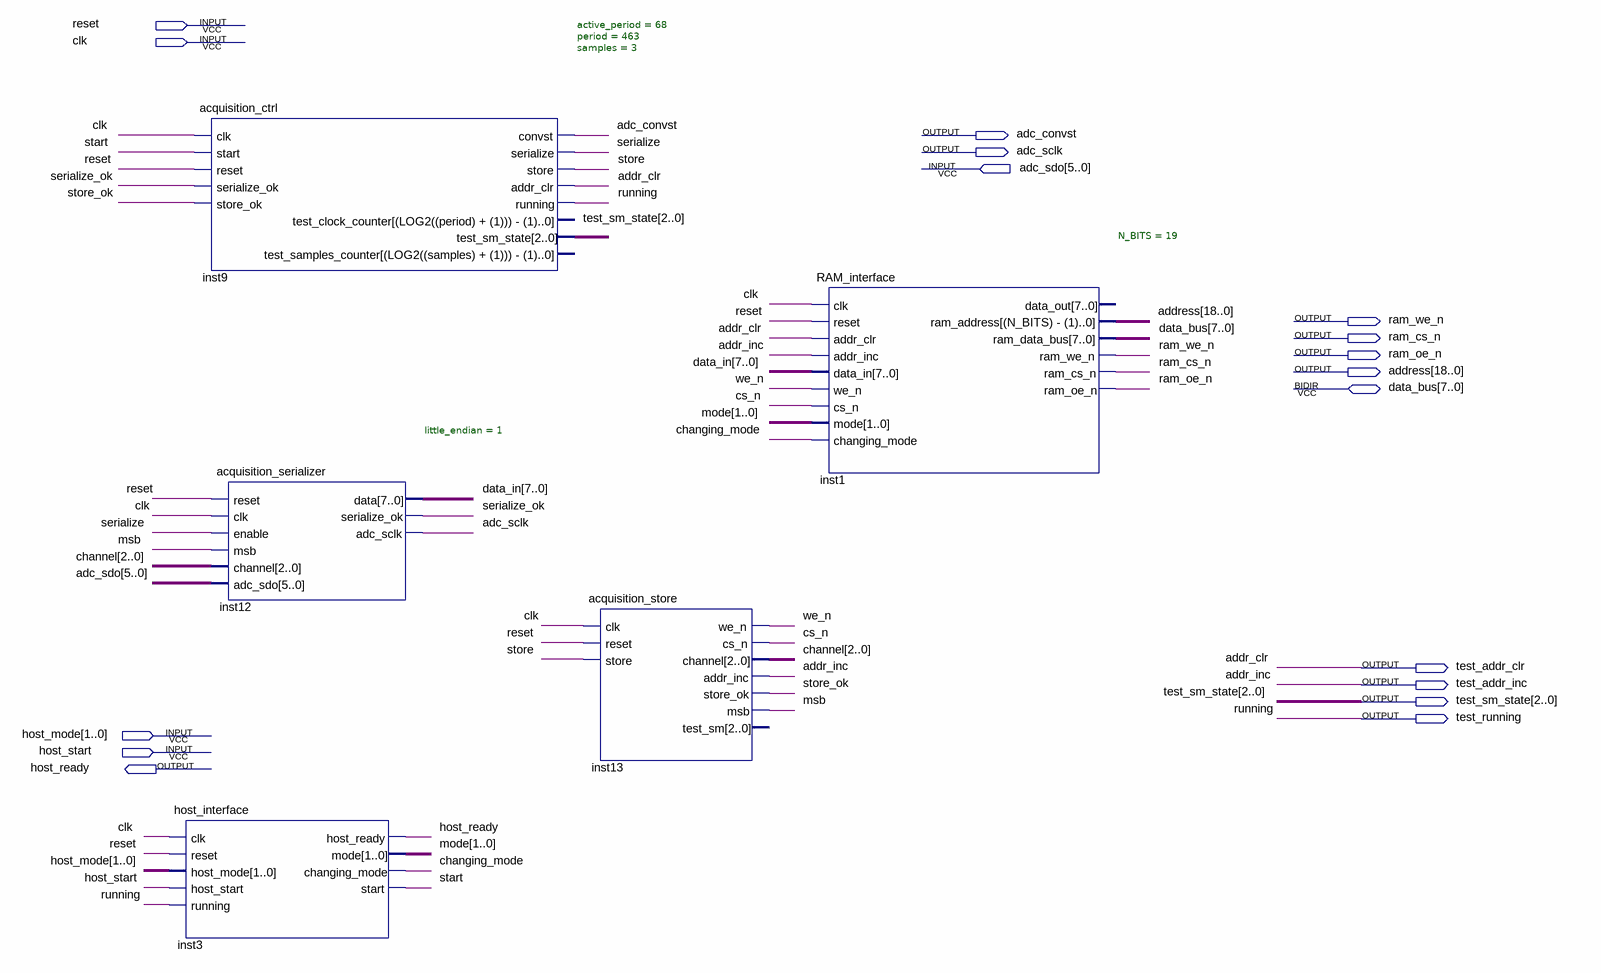
[diagram p0: schematic sheet]
// Quartus schematic acquisition_module.bdf as structural Verilog: 5 symbols, 17 pins
module acquisition_module (
  input  reset,
  input  clk,
  input  [5:0] adc_sdo,
  input  [1:0] host_mode,
  input  host_start,
  inout  [7:0] data_bus,
  output adc_convst,
  output adc_sclk,
  output ram_we_n,
  output ram_cs_n,
  output ram_oe_n,
  output [18:0] address,
  output test_addr_clr,
  output test_addr_inc,
  output [2:0] test_sm_state,
  output test_running,
  output host_ready
);

  wire changing_mode, cs_n, msb, serialize, serialize_ok, start, store, store_ok, we_n;
  wire [1:0] mode;
  wire [2:0] channel;
  wire [7:0] data_in;

  host_interface inst3 (
    .clk(clk), .reset(reset), .host_mode(host_mode), .host_start(host_start), .running(test_running),
    .host_ready(host_ready), .mode(mode), .changing_mode(changing_mode), .start(start));
  acquisition_ctrl #(.active_period(68), .period(463), .samples(3)) inst9 (
    .clk(clk), .start(start), .reset(reset), .serialize_ok(serialize_ok), .store_ok(store_ok),
    .convst(adc_convst), .serialize(serialize), .store(store), .addr_clr(test_addr_clr),
    .running(test_running), .test_sm_state(test_sm_state));  // open: test_clock_counter, test_samples_counter
  acquisition_serializer #(.little_endian(1)) inst12 (
    .reset(reset), .clk(clk), .enable(serialize), .msb(msb), .channel(channel), .adc_sdo(adc_sdo),
    .data(data_in), .serialize_ok(serialize_ok), .adc_sclk(adc_sclk));
  acquisition_store inst13 (
    .clk(clk), .reset(reset), .store(store), .we_n(we_n), .cs_n(cs_n), .channel(channel),
    .addr_inc(test_addr_inc), .store_ok(store_ok), .msb(msb));  // open: test_sm
  RAM_interface #(.N_BITS(19)) inst1 (
    .clk(clk), .reset(reset), .addr_clr(test_addr_clr), .addr_inc(test_addr_inc), .data_in(data_in),
    .we_n(we_n), .cs_n(cs_n), .mode(mode), .changing_mode(changing_mode), .ram_address(address),
    .ram_we_n(ram_we_n), .ram_cs_n(ram_cs_n), .ram_oe_n(ram_oe_n), .ram_data_bus(data_bus));  // open: data_out

  // Other names for the same wires on the sheet: addr_clr = test_addr_clr; addr_inc = test_addr_inc;
  //   running = test_running
endmodule
